# EasyEDA Pro project ECHO_RECEIVER.epro

# Schematic GROUND_STATION
Board Name: GROUND_STATION; Create Date: 2025-08-09; Page Name: Sheet_1; Project Name: GROUND_STATION_2025-08-09_01-57-34; Schematic Name: GROUND_STATION; Update Date: 2025-08-09; Add into BOM: yes; Company: Your Company; Convert to PCB: yes; Date: 2025-07-25; Draw By: davdasujal5215; REV: 1.0; Sheet: 1/1; spicePre: .
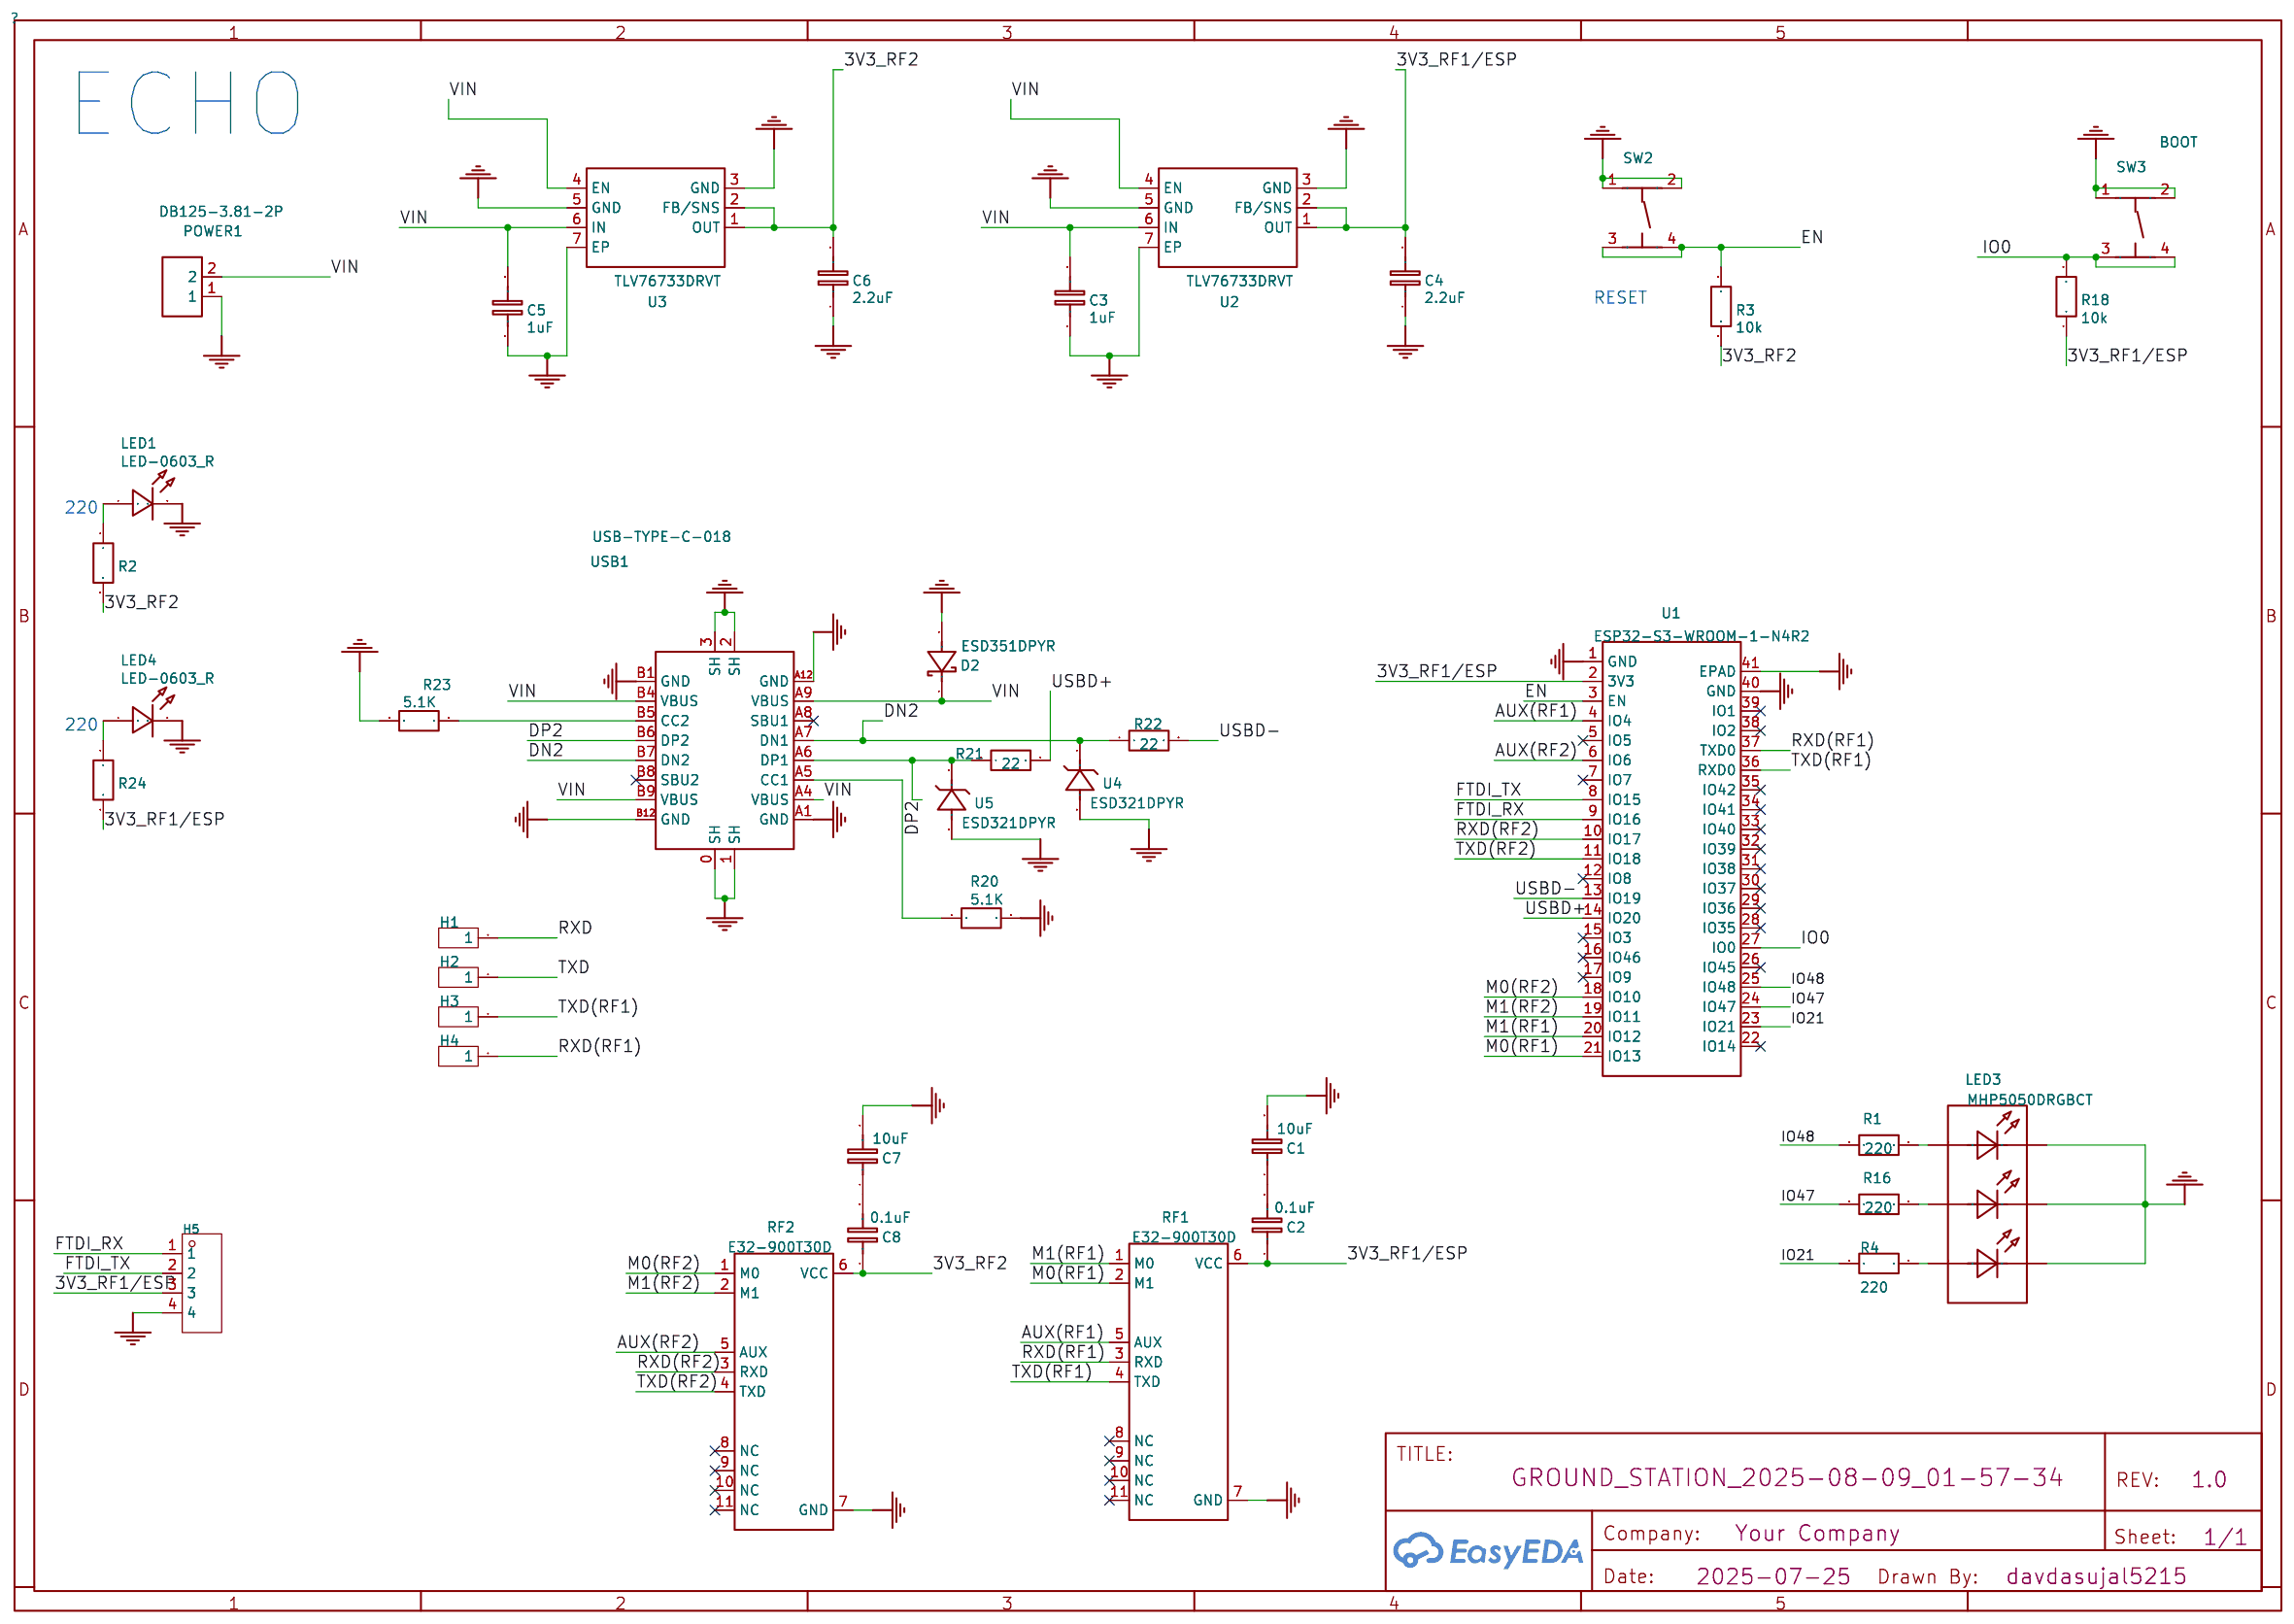
[diagram p0: schematic sheet]

## Parts
C1  10uF  [C0603]
C2  0.1uF  [C0603]
C3  1uF  [C0603]
C4  2.2uF  [C0603]
C5  1uF  [C0603]
C6  2.2uF  [C0603]
C7  10uF  [C0603]
C8  0.1uF  [C0603]
D2  ESD351DPYR  [X1SON-2_L1.0-W0.6-P0.65-RD-1]
H1  -  [HDR-TH_1P-V-M_XKB_X4611WV-01I-C28D40]
H2  -  [HDR-TH_1P-V-M_XKB_X4611WV-01I-C28D40]
H3  -  [HDR-TH_1P-V-M_XKB_X4611WV-01I-C28D40]
H4  -  [HDR-TH_1P-V-M_XKB_X4611WV-01I-C28D40]
H5  -  [HDR-TH_4P-P2.54-V-F]
LED1  LED-0603_R  [LED0603_RED]
LED3  MHP5050DRGBCT  [LED-SMD_6P-L5.0-W5.0-P1.60-LS4.4-TL_MHP5050DRGBCT]
LED4  LED-0603_R  [LED0603_RED]
POWER1  DB125-3.81-2P  [CONN-TH_2P-P3.81_L7.4-W7.6]
R1  220  [R0603]
R2  10k  [R0603]
R3  10k  [R0603]
R4  220  [R0603]
R16  220  [R0603]
R18  10k  [R0603]
R20  5.1K  [R0603]
R21  22  [R0603]
R22  22  [R0603]
R23  5.1K  [R0603]
R24  10k  [R0603]
RF1  E32-900T30D  [WIRELM-TH_E32-900T30D]
RF2  E32-900T30D  [WIRELM-TH_E32-900T30D]
SW2  RESET  [SW-SMD_4P-L4.5-W4.5-P3.00-LS7.0]
SW3  BOOT  [SW-SMD_4P-L4.5-W4.5-P3.00-LS7.0]
U1  ESP32-S3-WROOM-1-N4R2  [WIRELM-SMD_ESP32-S3-WROOM-1]
U2  TLV76733DRVT  [WSON-6_L2.0-W2.0-P0.65-TL-EP]
U3  TLV76733DRVT  [WSON-6_L2.0-W2.0-P0.65-TL-EP]
U4  ESD321DPYR  [X1SON-2_L1.0-W0.6-P0.65-RD]
U5  ESD321DPYR  [X1SON-2_L1.0-W0.6-P0.65-RD]
USB1  USB-TYPE-C-018  [USB-C_SMD-TYPE-C-31-M-12]

## Library data of the parts
C1 C7 = 10uF: nameAlias: Value(F); Contributor: LCEDA_Lib; spicePre: C; spiceSymbolName: C_0603_EU
C2 C8 = 0.1uF: nameAlias: Value(F); Contributor: LCEDA_Lib; spicePre: C; spiceSymbolName: C_0603_EU
C3 C5 = 1uF: nameAlias: Value(F); Contributor: LCEDA_Lib; spicePre: C; spiceSymbolName: C_0603_EU
C4 C6 = 2.2uF: nameAlias: Value(F); Contributor: LCEDA_Lib; spicePre: C; spiceSymbolName: C_0603_EU
D2 = ESD351DPYR: Supplier: LCSC; Supplier Part: C1974929; Manufacturer: TI(德州仪器); JLCPCB Part Class: Extended Part; Contributor: LCSC; spicePre: D
H1-H4 = HDR-M_2.54_1x1P: Supplier Footprint: Through
H5 = HDR-F_2.54_1x4P: Supplier Footprint: Through
LED1 LED4 = LED-0603_R: Manufacturer: EVERLIGHT(台湾亿光); Manufacturer Part: 19-217/R6C-AL1M2VY/3T; Supplier Part: C72044; Supplier: LCSC; Contributor: LCEDA_01; spicePre: L
LED3 = MHP5050DRGBCT: Supplier: LCSC; Supplier Part: C7470880; Manufacturer: MEIHUA(美华); JLCPCB Part Class: Extended Part; Contributor: lcsc; spicePre: L
POWER1 = DB125-3.81-2P: Supplier: LCSC; Supplier Part: C395878; Manufacturer: DORABO(地博电气); Manufacturer Part: DB125-3.81-2P-GN-S; JLCPCB Part Class: Extended Part; Contributor: LCSC; spicePre: U
R1 R4 R16 = 220: nameAlias: Value(Ω); Contributor: LCEDA_Lib; spicePre: R; spiceSymbolName: R_0603_EU
R2 R3 R18 R24 = 10k: nameAlias: Value(Ω); Contributor: LCEDA_Lib; spicePre: R; spiceSymbolName: R_0603_EU
R20 R23 = 5.1K: nameAlias: Value(Ω); Contributor: LCEDA_Lib; spicePre: R; spiceSymbolName: R_0603_EU
R21 R22 = 22: nameAlias: Value(Ω); Contributor: LCEDA_Lib; spicePre: R; spiceSymbolName: R_0603_EU
RF1 RF2 = E32-900T30D: Supplier: LCSC; Supplier Part: C9900133952; Manufacturer: null; Contributor: lcsc; spicePre: R
SW2 = RESET: Supplier: LCSC; Supplier Part: C397346; Manufacturer: XKB Enterprise; Manufacturer Part: TS-1109S-C-A; JLCPCB Part Class: Extended Part; Contributor: Igor Iks; spicePre: S; spiceSymbolName: TS-1109S-C-A
SW3 = BOOT: Supplier: LCSC; Supplier Part: C397346; Manufacturer: XKB Enterprise; Manufacturer Part: TS-1109S-C-A; JLCPCB Part Class: Extended Part; Contributor: Igor Iks; spicePre: S; spiceSymbolName: TS-1109S-C-A
U1 = ESP32-S3-WROOM-1-N4R2: Supplier: LCSC; Supplier Part: C2913203; Manufacturer: ESPRESSIF(乐鑫); JLCPCB Part Class: Extended Part; Contributor: lcsc; spicePre: U
U2 U3 = TLV76733DRVT: Supplier: LCSC; Supplier Part: C2867572; Manufacturer: TI(德州仪器); JLCPCB Part Class: Extended Part; Contributor: LCSC; spicePre: U
U4 U5 = ESD321DPYR: Supplier: LCSC; Supplier Part: C717890; Manufacturer: null; Contributor: LCSC; spicePre: U
USB1 = USB-TYPE-C-018: Supplier: LCSC; Supplier Part: C2927038; Manufacturer: DEALON(德艺隆); JLCPCB Part Class: Extended Part; Contributor: LCSC; spicePre: U

## Nets
3V3_RF2: C6.2 C8.1 R2.2 R3.2 RF2.6(VCC) U3.1(OUT) U3.2(FB/SNS)
GND: C1.2 C3.1 C4.1 C5.1 C6.1 C7.2 D2.2(A) H5.4 LED1.2 LED3.4(B-) LED3.5(R-) LED3.6(G-) LED4.2 POWER1.1 R20.2 R23.2 RF1.7(GND) RF2.7(GND) SW2.1 SW2.2 SW3.1 SW3.2 U1.1(GND) U1.40(GND) U1.41(EPAD) U2.3(GND) U2.5(GND) U2.7(EP) U3.3(GND) U3.5(GND) U3.7(EP) U4.2(A) U5.2(A) USB1.0(SH) USB1.1(SH) USB1.2(SH) USB1.3(SH) USB1.A1(GND) USB1.A12(GND) USB1.B1(GND) USB1.B12(GND)
VIN: C3.2 C5.2 D2.1(K) POWER1.2 U2.4(EN) U2.6(IN) U3.4(EN) U3.6(IN) USB1.A4(VBUS) USB1.A9(VBUS) USB1.B4(VBUS) USB1.B9(VBUS)
3V3_RF1/ESP: C2.1 C4.2 H5.3 R18.1 R24.2 RF1.6(VCC) U1.2(3V3) U2.1(OUT) U2.2(FB/SNS)
AUX(RF1): RF1.5(AUX) U1.4(IO4)
AUX(RF2): RF2.5(AUX) U1.6(IO6)
DN2: R22.1 U4.1(K) USB1.A7(DN1) USB1.B7(DN2)
DP2: R21.1 U5.1(K) USB1.A6(DP1) USB1.B6(DP2)
EN: R3.1 SW2.3 SW2.4 U1.3(EN)
FTDI_RX: H5.1 U1.9(IO16)
FTDI_TX: H5.2 U1.8(IO15)
IO0: R18.2 SW3.3 SW3.4 U1.27(IO0)
IO21: R4.2 U1.23(IO21)
IO47: R16.1 U1.24(IO47)
IO48: R1.1 U1.25(IO48)
M0(RF1): RF1.2(M1) U1.21(IO13)
M0(RF2): RF2.1(M0) U1.18(IO10)
M1(RF1): RF1.1(M0) U1.20(IO12)
M1(RF2): RF2.2(M1) U1.19(IO11)
RXD: H1.1
RXD(RF1): H4.1 RF1.3(RXD) U1.37(TXD0)
RXD(RF2): RF2.3(RXD) U1.10(IO17)
TXD: H2.1
TXD(RF1): H3.1 RF1.4(TXD) U1.36(RXD0)
TXD(RF2): RF2.4(TXD) U1.11(IO18)
USBD+: R21.2 U1.14(IO20)
USBD-: R22.2 U1.13(IO19)
$1N38: LED3.2(R+) R16.2
$1N40: LED3.1(G+) R1.2
$1N41: LED3.3(B+) R4.1
$1N63: R23.1 USB1.B5(CC2)
$1N65: R20.1 USB1.A5(CC1)
$1N94: LED1.1 R2.1
$1N901: C1.1 C2.2
$1N902: C7.1 C8.2
$1N3241: LED4.1 R24.1

Not connected (* = marked no-connect by the designer): RF1 8(NC)* 9(NC)* 10(NC)* 11(NC)*; RF2 8(NC)* 9(NC)* 10(NC)* 11(NC)*; U1 5(IO5)* 7(IO7)* 12(IO8)* 15(IO3)* 16(IO46)* 17(IO9)* 22(IO14)* 26(IO45)* 28(IO35)* 29(IO36)* 30(IO37)* 31(IO38)* 32(IO39)* 33(IO40)* 34(IO41)* 35(IO42)* 38(IO2)* 39(IO1)*; USB1 A8(SBU1)* B8(SBU2)*

## Notes on the sheet
- ECHO
- RESET
- 220
- 220

# Board PCB_GROUND_STATION
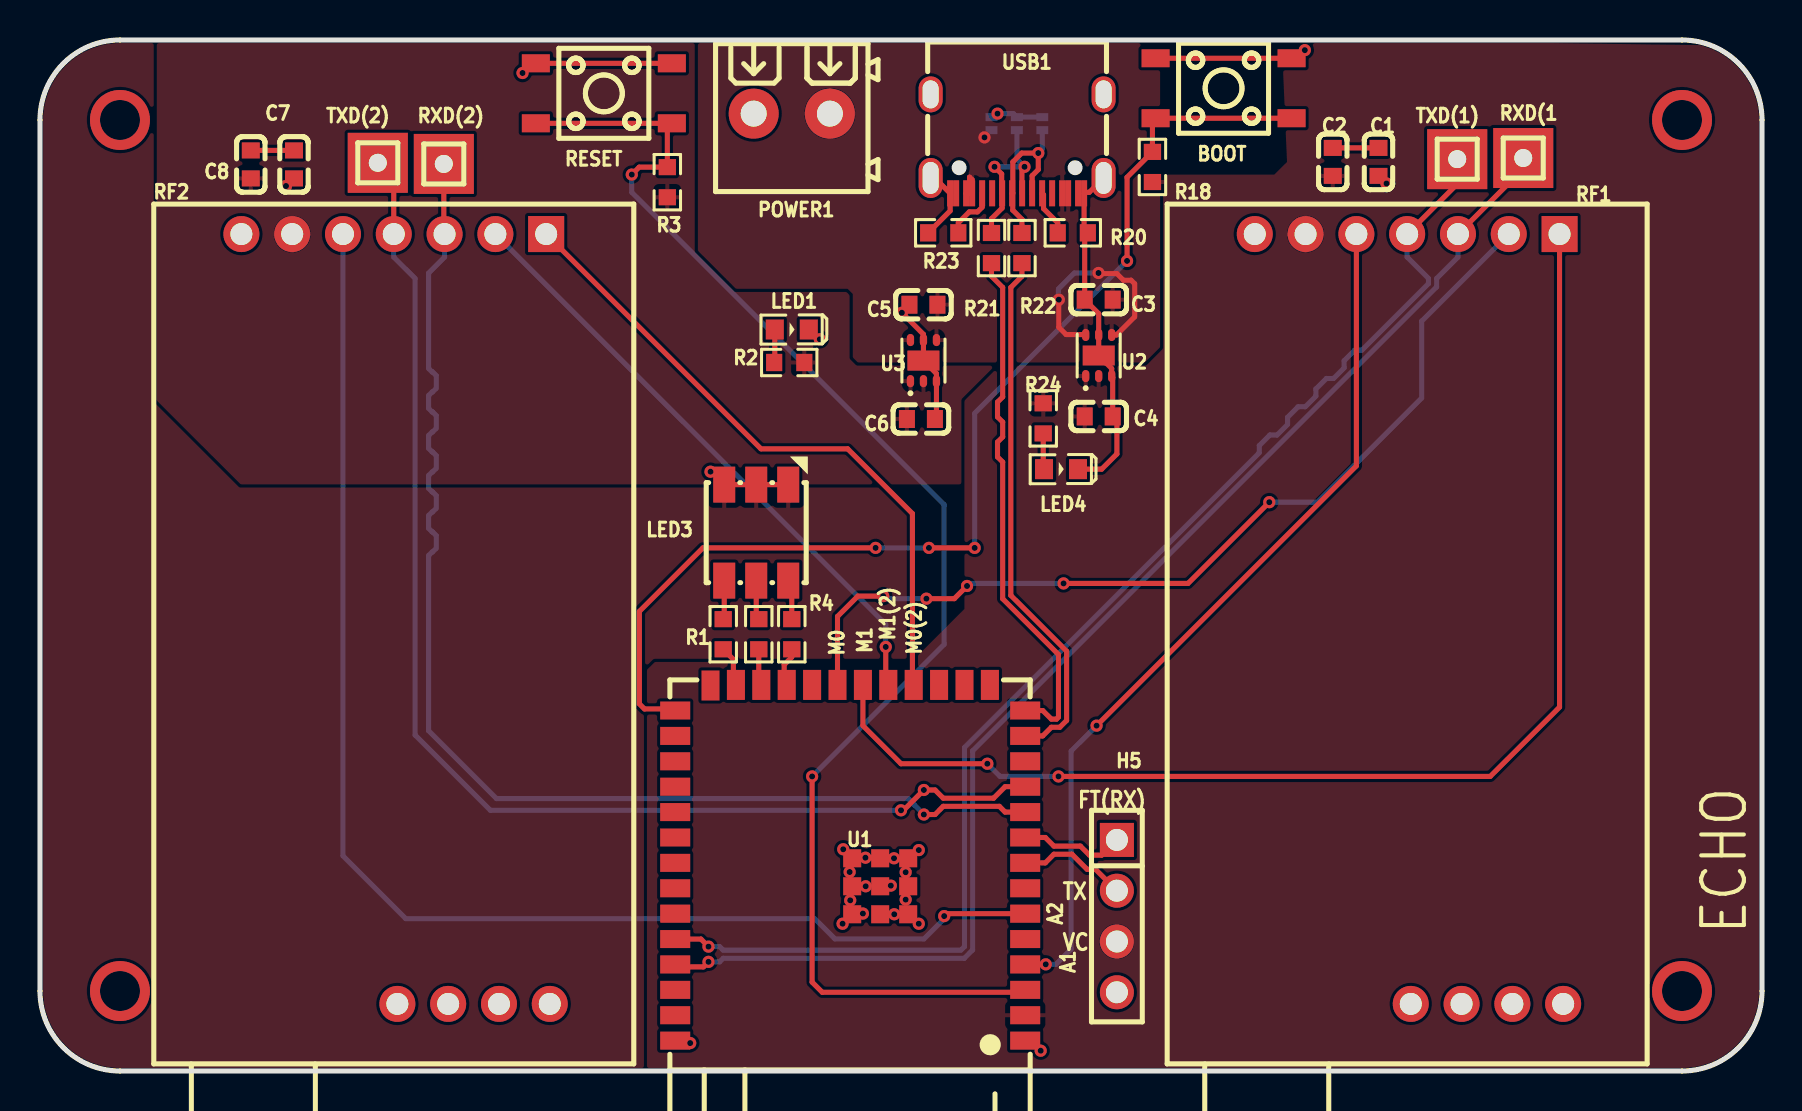
[diagram p1: board, top side]
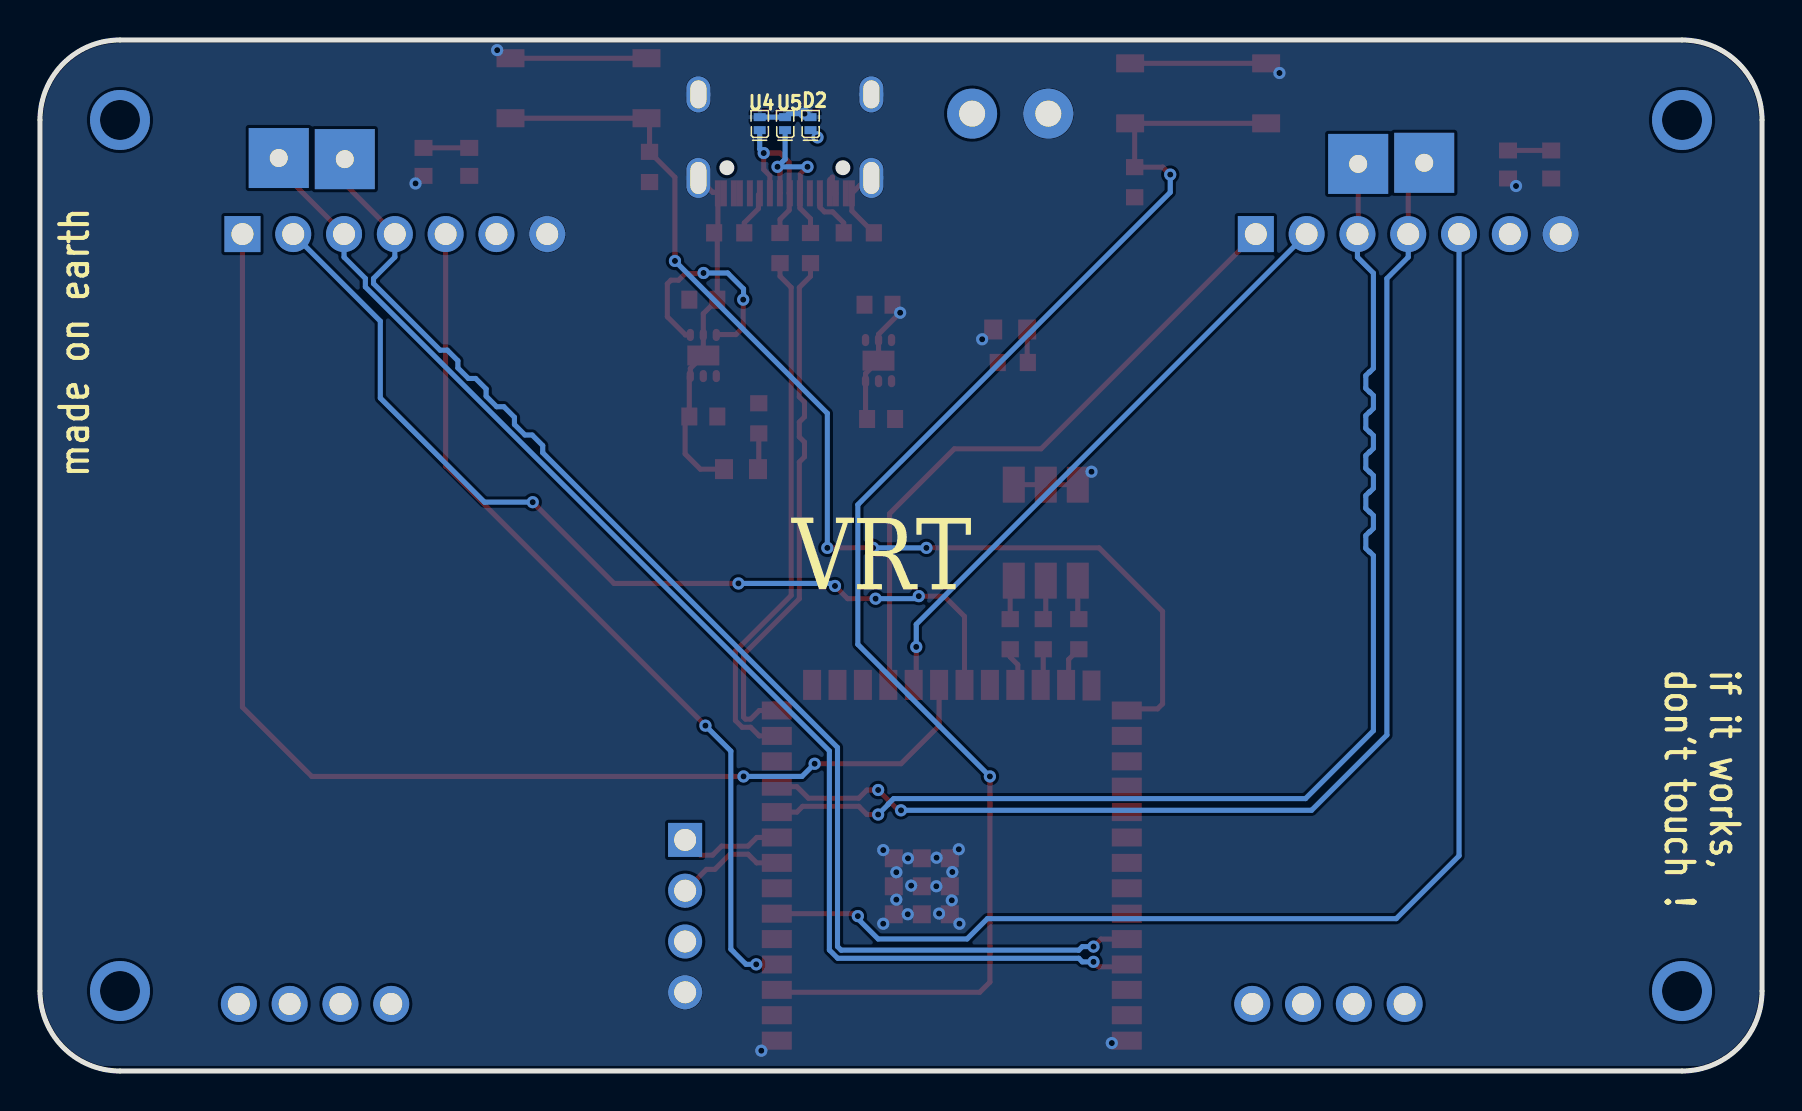
[diagram p2: board, bottom side, seen from below]

Outline 86.11 x 51.56 mm; copper layers: Top Layer, GND1, GND2, Bottom Layer. Coordinates in mm from the lower left corner of the outline.
Outline path: 0,47.56 0,4 arc(1.17,1.17) 4,0 82.11,0 arc(84.93,1.17) 86.11,4 86.11,47.56 arc(84.93,50.39) 82.11,51.56 4,51.56 arc(1.17,50.39) 0,47.56
Stack: Top Layer 0.035mm Outer layer thickness 1oz / Dielectric1 0.2104mm 7628 RC49% 8.6mil / GND1 0.0152mm Inner layer thickness / Dielectric2 1.065mm 1.1mm H/HOZ Copper / GND2 0.0152mm Inner layer thickness / Dielectric3 0.2104mm 7628 RC49% 8.6mil / Bottom Layer 0.035mm Outer layer thickness 1oz

## Design rules (mm)
net USBD+: DP1
net USBD-: DP1
net RXD(RF1): DP2
net TXD(RF1): DP2
net FTDI_TX: DP4
net FTDI_RX: DP4
net RXD(RF2): DP3
net TXD(RF2): DP3
spacing Default (default): track to track 0.152, other pairs 0 to 0.152
track width Default (default): min 0.254, default 0.254, max 25.4
differential pair differentialPair (default): width min 0.127, default 0.254, max 2.54; gap min 0.152, default 0.152
via Default (default): diameter min 0.61, default 0.61, max 100.025; hole min 0.305, default 0.305, max 59.995

## Placement (name value [footprint] x y rotation side)
BOOT  BOOT  [SW-SMD_4P-L4.5-W4.5-P3.00-LS7.0]  59.18 49.15 0 top
C1  10uF  [C0603]  66.93 45.47 270 top
C2  0.1uF  [C0603]  64.64 45.47 90 top
C3  1uF  [C0603]  52.94 38.58 0 top
C4  2.2uF  [C0603]  52.94 32.73 180 top
C5  1uF  [C0603]  44.18 38.32 0 top
C6  2.2uF  [C0603]  44.05 32.61 180 top
C7  10uF  [C0603]  12.7 45.34 270 top
C8  0.1uF  [C0603]  10.54 45.34 90 top
D2  ESD351DPYR  [X1SON-2_L1.0-W0.6-P0.65-RD-1]  47.58 47.38 90 bottom
H5  -  [HDR-TH_4P-P2.54-V-F]  53.85 7.75 270 top
LED1  LED-0603_R  [LED0603_RED]  37.59 37.08 0 top
LED3  MHP5050DRGBCT  [LED-SMD_6P-L5.0-W5.0-P1.60-LS4.4-TL_MHP5050DRGBCT]  35.81 26.92 90 top
LED4  LED-0603_R  [LED0603_RED]  51.05 30.1 0 top
POWER1  DB125-3.81-2P  [CONN-TH_2P-P3.81_L7.4-W7.6]  37.59 47.88 0 top
R1  220  [R0603]  34.16 21.84 90 top
R2  10k  [R0603]  37.47 35.43 0 top
R3  10k  [R0603]  31.37 44.45 270 top
R4  220  [R0603]  37.59 21.84 270 top
R16  220  [R0603]  35.94 21.84 90 top
R18  10k  [R0603]  55.63 45.21 90 top
R20  5.1K  [R0603]  51.64 41.92 0 top
R21  22  [R0603]  47.58 41.16 270 top
R22  22  [R0603]  49.1 41.16 270 top
R23  5.1K  [R0603]  45.17 41.92 180 top
R24  10k  [R0603]  50.16 32.64 90 top
RESET  RESET  [SW-SMD_4P-L4.5-W4.5-P3.00-LS7.0]  28.19 48.9 0 top
RF1  E32-900T30D  [WIRELM-TH_E32-900T30D]  68.45 22.61 0 top
RF2  E32-900T30D  [WIRELM-TH_E32-900T30D]  17.78 22.61 0 top
RXD(1  -  [HDR-TH_1P-V-M_XKB_X4611WV-01I-C28D40]  74.17 45.66 0 top
RXD(2)  -  [HDR-TH_1P-V-M_XKB_X4611WV-01I-C28D40]  20.19 45.36 0 top
TXD(1)  -  [HDR-TH_1P-V-M_XKB_X4611WV-01I-C28D40]  70.87 45.6 0 top
TXD(2)  -  [HDR-TH_1P-V-M_XKB_X4611WV-01I-C28D40]  16.89 45.42 0 top
U1  ESP32-S3-WROOM-1-N4R2  [WIRELM-SMD_ESP32-S3-WROOM-1]  40.51 10.41 180 top
U2  TLV76733DRVT  [WSON-6_L2.0-W2.0-P0.65-TL-EP]  52.94 35.78 90 top
U3  TLV76733DRVT  [WSON-6_L2.0-W2.0-P0.65-TL-EP]  44.18 35.53 90 top
U4  ESD321DPYR  [X1SON-2_L1.0-W0.6-P0.65-RD]  50.12 47.38 90 bottom
U5  ESD321DPYR  [X1SON-2_L1.0-W0.6-P0.65-RD]  48.85 47.38 90 bottom
USB1  USB-TYPE-C-018  [USB-C_SMD-TYPE-C-31-M-12]  48.86 46.37 180 top

## Footprints (pads in the part's own frame, mm; a bottom-side part is the same pattern mirrored in y, then rotated)
C0603
  rect 0.8x0.9 smd: 1(-0.7,0) 2(0.7,0)
CONN-TH_2P-P3.81_L7.4-W7.6
  round 2.5 hole 1.3: 1(-1.905,0) 2(1.905,0)
HDR-TH_1P-V-M_XKB_X4611WV-01I-C28D40
  rect 3x3 hole 0.9x0.003: 1(0,0)
HDR-TH_4P-P2.54-V-F
  rect 1.7x1.7 hole 1.1: 1(-3.81,0)
  round 1.7 hole 1.1: 2(-1.27,0) 3(1.27,0) 4(3.81,0)
LED0603_RED
  rect 0.9x1 smd: 1(-0.85,0) 2(0.85,0)
LED-SMD_6P-L5.0-W5.0-P1.60-LS4.4-TL_MHP5050DRGBCT
  rect 1.8x1.1 smd: 1(-2.4,1.6) 2(-2.4,0) 3(-2.4,-1.6) 4(2.4,-1.6) 5(2.4,0) 6(2.4,1.6)
R0603
  rect 0.806x0.864 smd: 1(-0.753,0) 2(0.753,0)
SW-SMD_4P-L4.5-W4.5-P3.00-LS7.0
  rect 1.4x0.9 smd: 1(-3.4,1.5) 2(3.4,1.5) 3(-3.4,-1.5) 4(3.4,-1.5)
USB-C_SMD-TYPE-C-31-M-12
  oval 1.2x2 hole 0.8x1.6: 0(-4.325,1.706) 1(4.325,1.706)
  oval 1.2x1.8 hole 0.8x1.4: 2(4.325,-2.474) 3(-4.325,-2.474)
  rect 0.3x1.3 smd: A1(-3.35,2.474) A4(-2.55,2.474) A5(-1.25,2.474) A6(-0.25,2.474) A7(0.25,2.474) A8(1.25,2.474) A9(2.55,2.474) A12(3.35,2.474) B1(3.05,2.474) B4(2.25,2.474) B5(1.75,2.474) B6(0.75,2.474) B7(-0.75,2.474) B8(-1.75,2.474) B9(-2.25,2.474) B12(-3.05,2.474)
WIRELM-SMD_ESP32-S3-WROOM-1
  rect 1.5x0.9 smd: 1(-8.75,8.895) 2(-8.75,7.625) 3(-8.75,6.355) 4(-8.75,5.085) 5(-8.75,3.815) 6(-8.75,2.545) 7(-8.75,1.275) 8(-8.75,0.005) 9(-8.75,-1.265) 10(-8.75,-2.535) 11(-8.75,-3.805) 12(-8.75,-5.075) 13(-8.75,-6.345) 14(-8.75,-7.615) 27(8.75,-7.615) 28(8.75,-6.345) 29(8.75,-5.075) 30(8.75,-3.805) 31(8.75,-2.535) 32(8.75,-1.265) 33(8.75,0.005) 34(8.75,1.275) 35(8.75,2.545) 36(8.75,3.815) 37(8.75,5.085) 38(8.75,6.355) 39(8.75,7.625) 40(8.75,8.895)
  rect 0.9x1.5 smd: 15(-6.985,-8.895) 16(-5.715,-8.895) 17(-4.445,-8.895) 18(-3.175,-8.895) 19(-1.905,-8.895) 20(-0.635,-8.895) 21(0.635,-8.895) 22(1.905,-8.895) 23(3.175,-8.895) 24(4.445,-8.895) 25(5.715,-8.895) 26(6.985,-8.865)
  rect 0.9x0.9 smd: 41(-2.9,2.575) 41(-2.9,1.175) 41(-2.9,-0.225) 41(-1.5,2.575) 41(-1.5,1.175) 41(-1.5,-0.225) 41(-0.1,2.575) 41(-0.1,1.175) 41(-0.1,-0.225)
WIRELM-TH_E32-900T30D
  rect 1.8x1.8 hole 1.1: 1(7.53,19.25)
  round 1.8 hole 1.1: 2(4.99,19.25) 3(2.45,19.25) 4(-0.09,19.25) 5(-2.63,19.25) 6(-5.17,19.25) 7(-7.71,19.25) 8(0.09,-19.25) 9(2.63,-19.25) 10(5.17,-19.25) 11(7.71,-19.25)
WSON-6_L2.0-W2.0-P0.65-TL-EP
  oval 0.607x0.364 smd: 1(-1.028,0.65) 2(-1.028,0) 3(-1.028,-0.65) 4(1.028,-0.65) 5(1.028,0) 6(1.028,0.65)
  rect 1x1.6 smd: 7(0,0)
X1SON-2_L1.0-W0.6-P0.65-RD
  rect 0.4x0.6 smd: 1(-0.325,0) 2(0.325,0)
X1SON-2_L1.0-W0.6-P0.65-RD-1
  rect 0.4x0.6 smd: 1(-0.325,0) 2(0.325,0)

## Nets
3V3_RF2: C6.2 C8.1 R2.2 R3.2 RF2.6 U3.1 U3.2
GND: BOOT.1 BOOT.2 C1.2 C3.1 C4.1 C5.1 C6.1 C7.2 D2.2 H5.4 LED1.2 LED3.4 LED3.5 LED3.6 LED4.2 POWER1.1 R20.2 R23.2 RESET.1 RESET.2 RF1.7 RF2.7 U1.1 U1.40 U1.41 U2.3 U2.5 U2.7 U3.3 U3.5 U3.7 U4.2 U5.2 USB1.0 USB1.1 USB1.2 USB1.3 USB1.A1 USB1.A12 USB1.B1 USB1.B12
VIN: C3.2 C5.2 D2.1 POWER1.2 U2.4 U2.6 U3.4 U3.6 USB1.A4 USB1.A9 USB1.B4 USB1.B9
3V3_RF1/ESP: C2.1 C4.2 H5.3 R18.1 R24.2 RF1.6 U1.2 U2.1 U2.2
AUX(RF1): RF1.5 U1.4
AUX(RF2): RF2.5 U1.6
DN2: R22.1 U4.1 USB1.A7 USB1.B7
DP2: R21.1 U5.1 USB1.A6 USB1.B6
EN: R3.1 RESET.3 RESET.4 U1.3
FTDI_RX: H5.1 U1.9
FTDI_TX: H5.2 U1.8
IO0: BOOT.3 BOOT.4 R18.2 U1.27
IO21: R4.2 U1.23
IO47: R16.1 U1.24
IO48: R1.1 U1.25
M0(RF1): RF1.2 U1.21
M0(RF2): RF2.1 U1.18
M1(RF1): RF1.1 U1.20
M1(RF2): RF2.2 U1.19
RXD(RF1): RF1.3 RXD(1.1 U1.37
RXD(RF2): RF2.3 RXD(2).1 U1.10
TXD(RF1): RF1.4 TXD(1).1 U1.36
TXD(RF2): RF2.4 TXD(2).1 U1.11
USBD+: R21.2 U1.14
USBD-: R22.2 U1.13
$1N38: LED3.2 R16.2
$1N40: LED3.1 R1.2
$1N41: LED3.3 R4.1
$1N63: R23.1 USB1.B5
$1N65: R20.1 USB1.A5
$1N94: LED1.1 R2.1
$1N901: C1.1 C2.2
$1N902: C7.1 C8.2
$1N3241: LED4.1 R24.1

Pads without a net: RF1 8 9 10 11; RF2 8 9 10 11; U1 5 7 12 15 16 17 22 26 28 29 30 31 32 33 34 35 38 39; USB1 A8 B8

## Via types
v1: diameter 3, hole 2, Top Layer to Bottom Layer, 4 vias
v2: diameter 0.61, hole 0.305, Top Layer to Bottom Layer, 52 vias

## Routing (per net, layer and track width the routed paths; a pad name or vN(x,y) marks a point on that pad's centre or on a via; arc(x,y) is an arc through that point)
GND: length 47.7
  Top Layer w0.254: LED3.4 LED3.5 LED3.6 ; C6.1 44.83,32.68 U3.3 44.83,34.88 U3.7 U3.5 44.18,36.84 v2(43.1,37.92) ; R23.2 45.51,43.02 USB1.A12 44.74,44.66 USB1.1 ; RESET.1 RESET.2 ; LED4.2 53.09,30.1 53.85,30.86 53.85,32.53 C4.1 53.64,34.7 U2.3 53.59,35.13 U2.7 U2.5 52.94,37.88 C3.1 52.24,41.76 R20.2 52.21,42.1 USB1.A1 52.26,43.94 52.46,43.94 USB1.0 ; v2(42.7,10.64) 42.68,10.67 v2(41.28,10.67) ; 55.66,50.65 62.46,50.65
  Bottom Layer w0.254: v2(47.88,47.88) 48.67,47.88 U5.2 U4.2
  vias: v2(12.3,44.26) v2(24.13,49.91) v2(32.51,1.4) v2(33.53,29.97) v2(39,36.59) v2(40.13,7.37) v2(40.16,11.09) v2(40.49,9.95) v2(40.51,8.54) v2(41.15,7.87) v2(41.29,9.24) v2(42.54,9.27) v2(42.72,7.84) v2(43.29,9.94) v2(43.29,8.57) v2(43.94,11.05) v2(43.94,7.37) v2(50.04,1.02) v2(63.25,51.05) v2(67.33,44.39)
VIN: length 12.8
  Top Layer w0.254: U2.4 53.83,36.81 54.74,37.72 54.74,39.37 54.56,39.55 54.18,39.55 53.85,39.88 52.96,39.88 v2(52.93,39.91) ; v2(50.94,38.58) 50.94,37.19 51.31,36.83 52.27,36.83 U2.6 ; 46.61,43.9 46.61,44.58 46.48,44.7 46.48,44.07 USB1.A9 USB1.B4
  Bottom Layer w0.254: v2(52.93,39.91) 51.72,39.91 50.93,39.12 50.93,38.74
  vias: v2(47.23,46.69)
(no net):
  vias: v1(4,47.56) v1(4,4) v1(82.11,47.56) v1(82.11,4)
AUX(RF1): length 44.3
  Top Layer w0.254: v2(52.83,17.27) 65.82,30.26 RF1.5 ; U1.4 50.29,5.33 v2(50.29,5.33)
  Bottom Layer w0.254: v2(52.83,17.27) 51.56,16 51.56,6.1 50.8,5.33 v2(50.29,5.33)
AUX(RF2): length 67.5
  Top Layer w0.254: v2(45.21,7.75) 45.33,7.87 U1.6
  Bottom Layer w0.254: RF2.5 15.15,10.76 18.29,7.62 38.74,7.62 39.75,6.6 44.2,6.6 45.21,7.62 v2(45.21,7.75)
DN2: length 8.7
  Top Layer w0.254: 49.99,45.86 49.94,45.91 v2(49.92,45.91) ; v2(49.92,45.91) 49.92,45.08 49.61,44.77 USB1.B7 ; v2(49.92,45.91) 49.09,45.91 48.65,45.46 48.65,43.93 USB1.A7 48.64,43.86 48.64,43.05 49.1,42.59 R22.1
  Bottom Layer w0.254: v2(49.92,45.91) 50.12,46.11 U4.1
DP2: length 8.6
  Top Layer w0.254: USB1.A6 49.1,43.9 49.1,45.09 v2(49.23,45.22) ; R21.1 47.58,42.63 48.11,43.16 USB1.B6 48.09,43.92 48.09,44.86 v2(47.73,45.22)
  Bottom Layer w0.254: v2(47.73,45.22) v2(49.23,45.22) 48.85,45.6 U5.1
EN: length 71.5
  Top Layer w0.254: v2(29.59,44.83) 29.96,45.2 R3.1 31.37,47.17 RESET.4 RESET.3 ; 49.26,4.06 49.14,3.94 39.12,3.94 38.61,4.45 v2(38.61,14.73)
  Bottom Layer w0.254: v2(38.61,14.73) 45.21,21.34 45.21,28.32 29.59,43.94 v2(29.59,44.83)
FTDI_RX: length 5.3
  Top Layer w0.254: U1.9 50.27,11.68 50.7,11.25 52.02,11.25 52.48,10.8 53.09,10.8 H5.1
FTDI_TX: length 5.5
  Top Layer w0.254: H5.2 52.78,10.08 52.36,10.08 51.6,10.84 50.7,10.84 50.27,10.41 U1.8
IO0: length 56.6
  Top Layer w0.254: v2(54.36,40.51) 54.36,44.7 R18.2 55.63,47.62 55.66,47.65 62.46,47.65 ; v2(41.78,26.16) 33.15,26.16 29.97,22.99 29.97,18.36 30.23,18.11 31.68,18.11 U1.27 ; v2(46.74,26.16) v2(44.45,26.16)
  Bottom Layer w0.254: v2(44.45,26.16) v2(41.78,26.16) ; v2(54.36,40.51) 46.74,32.89 v2(46.74,26.16)
IO21: length 1.9
  Top Layer w0.254: 37.21,19.31 37.21,20.32 37.59,20.7 R4.2
IO47: length 1.8
  Top Layer w0.254: R16.1 35.94,19.31
IO48: length 2
  Top Layer w0.254: R1.1 34.67,20.58 34.67,19.31
M0(RF1): length 47.3
  Top Layer w0.254: U1.21 39.88,22.73 40.89,23.75 v2(42.16,23.75) ; v2(46.35,24.26) 45.72,23.62 v2(44.32,23.62) ; v2(61.47,28.45) 57.4,24.38 v2(51.18,24.38)
  Bottom Layer w0.254: v2(44.32,23.62) 42.29,23.62 v2(42.16,23.75) ; RF1.2 69.09,37.5 69.09,33.66 63.88,28.45 v2(61.47,28.45) ; v2(51.18,24.38) 46.48,24.38 v2(46.35,24.26)
M0(RF2): length 32.7
  Top Layer w0.254: U1.18 43.62,19.37 43.62,27.88 40.39,31.12 36.05,31.12 RF2.1
M1(RF1): length 63
  Top Layer w0.254: v2(47.37,15.37) 43.05,15.37 41.15,17.27 U1.20 ; v2(50.93,14.73) 72.52,14.73 75.98,18.2 RF1.1
  Bottom Layer w0.254: v2(50.93,14.73) 48.01,14.73 v2(47.37,15.37)
M1(RF2): length 30.7
  Top Layer w0.254: v2(42.29,21.21) 42.29,19.44 U1.19
  Bottom Layer w0.254: v2(42.29,21.21) 42.29,22.34 RF2.2
RXD(RF1): length 66.4
  Top Layer w0.254: v2(33.43,5.46) 33.17,5.21 31.76,5.21 31.64,5.33 ; RF1.3 74.17,45.12 RXD(1.1
  Bottom Layer w0.254: RF1.3 70.9,40.7 69.84,39.64 69.84,39.21 46.63,16.01 46.63,6.05 46.22,5.64 34.16,5.64 33.99,5.46 v2(33.43,5.46)
RXD(RF2): length 62.3
  Top Layer w0.254: v2(44.2,12.83) 44.75,12.83 45.16,13.24 47.97,13.24 48.26,12.95 U1.10 ; RF2.3 20.19,41.89 RXD(2).1
  Bottom Layer w0.254: v2(44.2,12.83) 43.7,13.32 43.7,13.34 43.42,13.62 22.83,13.62 19.43,17.02 19.43,25.78 19.61,25.96 19.63,25.96 19.81,26.14 19.81,26.78 19.63,26.96 19.61,26.96 19.43,27.14 19.43,27.78 19.61,27.96 19.63,27.96 19.81,28.14 19.81,28.78 19.63,28.96 19.61,28.96 19.43,29.14 19.43,29.78 19.61,29.96 19.63,29.96 19.81,30.14 19.81,30.78 19.63,30.96 19.61,30.96 19.43,31.14 19.43,31.78 19.61,31.96 19.63,31.96 19.81,32.14 19.81,32.78 19.63,32.96 19.61,32.96 19.43,33.14 19.43,33.78 19.61,33.96 19.63,33.96 19.81,34.14 19.81,34.78 19.63,34.96 19.61,34.96 19.43,35.14 19.43,39.9 20.23,40.7 RF2.3
TXD(RF1): length 66.2
  Top Layer w0.254: 31.64,6.6 33.05,6.6 v2(33.43,6.22) ; RF1.4 70.87,44.36 TXD(1).1
  Bottom Layer w0.254: RF1.4 68.36,40.7 69.43,39.64 69.43,39.38 66.1,36.05 65.74,36.05 65.21,35.52 65.21,35.16 64.68,34.64 64.32,34.64 63.8,34.11 63.8,33.75 63.27,33.22 62.91,33.22 62.38,32.69 62.38,32.33 61.85,31.81 61.5,31.81 60.97,31.28 60.97,30.92 46.23,16.18 46.23,6.22 46.05,6.04 34.16,6.04 33.99,6.22 v2(33.43,6.22)
TXD(RF2): length 62.3
  Top Layer w0.254: 49.26,14.22 48.26,14.22 47.68,13.64 45.16,13.64 44.75,14.05 v2(44.2,14.05) 43.18,13.04 v2(43.05,13.04) ; TXD(2).1 17.69,44.62 RF2.4
  Bottom Layer w0.254: v2(43.05,13.04) 22.52,13.04 18.76,16.8 18.76,39.64 17.69,40.7 RF2.4
USBD+: length 26.5
  Top Layer w0.254: 49.14,18.03 50.14,18.03 50.57,17.6 50.83,17.6 50.93,17.7 50.93,20.83 48.14,23.62 48.14,30.45 47.88,30.71 47.88,31.45 48.14,31.71 48.14,32.45 47.88,32.71 47.88,33.45 48.14,33.71 48.14,39.19 47.58,39.75 R21.2
USBD-: length 26.8
  Top Layer w0.254: 49.14,16.76 50.14,16.76 50.57,17.19 50.99,17.19 51.33,17.53 51.33,21 48.54,23.79 48.54,39.19 49.1,39.75 R22.2
$1N38: length 2
  Top Layer w0.254: R16.2 35.81,22.72 LED3.2
$1N40: length 1.9
  Top Layer w0.254: R1.2 34.21,22.65 LED3.1
$1N41: length 2
  Top Layer w0.254: LED3.3 37.59,24.35 R4.1
$1N63: length 2.7
  Top Layer w0.254: R23.1 45.92,42.42 46.47,42.97 46.88,42.97 47.11,43.2 USB1.B5
$1N65: length 2.3
  Top Layer w0.254: 50.89,41.92 50.89,42.42 50.18,43.13 50.18,43.82 USB1.A5
$1N94: length 1.7
  Top Layer w0.254: R2.1 36.74,35.46 LED1.1
$1N901: length 2.3
  Top Layer w0.254: C2.2 C1.1
$1N902: length 2.2
  Top Layer w0.254: C8.2 C7.1
$1N3241: length 1.8
  Top Layer w0.254: R24.1 50.16,30.14 LED4.1

## Copper pours and planes (outline as drawn; the poured copper is in the pictures)
3V3_RF2 on Top Layer: 64.31,51.87 5.84,51.87 5.84,33.53 10.03,29.34 61.47,29.34 63.63,31.5 63.63,51.18
GND on Top Layer: -1.02,51.94 86.74,51.94 86.87,51.82 86.87,-0.25 87.63,-1.02 87.12,-1.52 -1.65,-1.52 -1.65,51.31
GND on Bottom Layer: -2.67,56.26 -4.44,0 0.76,0.25 89.15,0.25 90.04,-0.63 90.04,52.96 86.36,56.64
GND on GND1: 43.17,45.17 44.44,45.17 44.44,44.16 43.17,44.16
GND on GND1: 33.56,48.51 35.06,48.51 35.06,47.25 33.56,47.25
GND on GND1: 0.16,51.41 85.95,51.41 85.95,0.16 0.16,0.16
GND on GND1: 8.46,42.31 9.63,42.31 9.63,41.4 8.46,41.4
GND on GND1: 60.29,43.47 61.2,43.47 61.2,42.3 60.29,42.3
GND on GND1: 9.62,43.47 10.52,43.47 10.52,42.3 9.62,42.3
GND on GND1: 44.68,49.3 45.85,49.3 45.85,48.39 44.68,48.39
GND on GND1: 53.28,45.17 54.55,45.17 54.55,44.16 53.28,44.16
GND on GND1: 9.62,41.41 10.52,41.41 10.52,40.24 9.62,40.24
GND on GND1: 43.22,49.3 44.39,49.3 44.39,48.39 43.22,48.39
GND on GND1: 51.87,49.3 53.04,49.3 53.04,48.39 51.87,48.39
GND on GND1: 59.13,42.31 60.3,42.31 60.3,41.4 59.13,41.4
GND on GND1: 60.29,41.41 61.2,41.41 61.2,40.24 60.29,40.24
GND on GND1: 36.31,48.51 37.82,48.51 37.82,47.25 36.31,47.25
GND on GND1: 35.06,47.26 36.31,47.26 36.31,45.75 35.06,45.75
GND on GND1: 53.33,49.3 54.5,49.3 54.5,48.39 53.33,48.39
GND on GND1: 35.06,50.01 36.31,50.01 36.31,48.5 35.06,48.5
GND on GND2: 33.56,48.51 35.06,48.51 35.06,47.25 33.56,47.25
GND on GND2: 60.29,43.47 61.2,43.47 61.2,42.3 60.29,42.3
GND on GND2: 36.31,48.51 37.82,48.51 37.82,47.25 36.31,47.25
GND on GND2: 0.16,51.41 85.95,51.41 85.95,0.16 0.16,0.16
GND on GND2: 51.87,49.3 53.04,49.3 53.04,48.39 51.87,48.39
GND on GND2: 43.17,45.17 44.44,45.17 44.44,44.16 43.17,44.16
GND on GND2: 35.06,50.01 36.31,50.01 36.31,48.5 35.06,48.5
GND on GND2: 43.22,49.3 44.39,49.3 44.39,48.39 43.22,48.39
GND on GND2: 53.28,45.17 54.55,45.17 54.55,44.16 53.28,44.16
GND on GND2: 8.46,42.31 9.63,42.31 9.63,41.4 8.46,41.4
GND on GND2: 53.33,49.3 54.5,49.3 54.5,48.39 53.33,48.39
GND on GND2: 44.68,49.3 45.85,49.3 45.85,48.39 44.68,48.39
GND on GND2: 9.62,43.47 10.52,43.47 10.52,42.3 9.62,42.3
GND on GND2: 59.13,42.31 60.3,42.31 60.3,41.4 59.13,41.4
GND on GND2: 35.06,47.26 36.31,47.26 36.31,45.75 35.06,45.75
GND on GND2: 60.29,41.41 61.2,41.41 61.2,40.24 60.29,40.24
GND on GND2: 9.62,41.41 10.52,41.41 10.52,40.24 9.62,40.24
VIN on Top Layer: 32.89,51.56 32.89,41.02 34.8,39.12 40.39,39.12 40.64,38.86 40.64,35.69 40.89,35.43 55.25,35.43 56.01,36.2 56.01,51.69 56.26,51.94 33.27,51.94
3V3_RF1/ESP on Top Layer: 85.98,51.27 62.09,51.59 62.35,45.46 61.72,44.83 55.62,44.83 49.98,39.2 49.98,37.28 46.23,33.53 46.23,23.11 43.57,20.46 30.75,20.46 30.35,20.07 30.35,0 85.98,0

Small or netless copper shapes (teardrops, artwork), in the pictures only: 12 on GND1, 12 on GND2

## Text on the board
Bottom Silkscreen Layer: if it works, / don't touch ! | made on earth | VRT
Top Silkscreen Layer: M0 | M1 | M1(2) | M0(2) | A2 | A1 | TX | VC | FT(RX) | ECHO
